# EAGLE schematic wirelessSensor 0.1 (EAGLE 7.6.0)
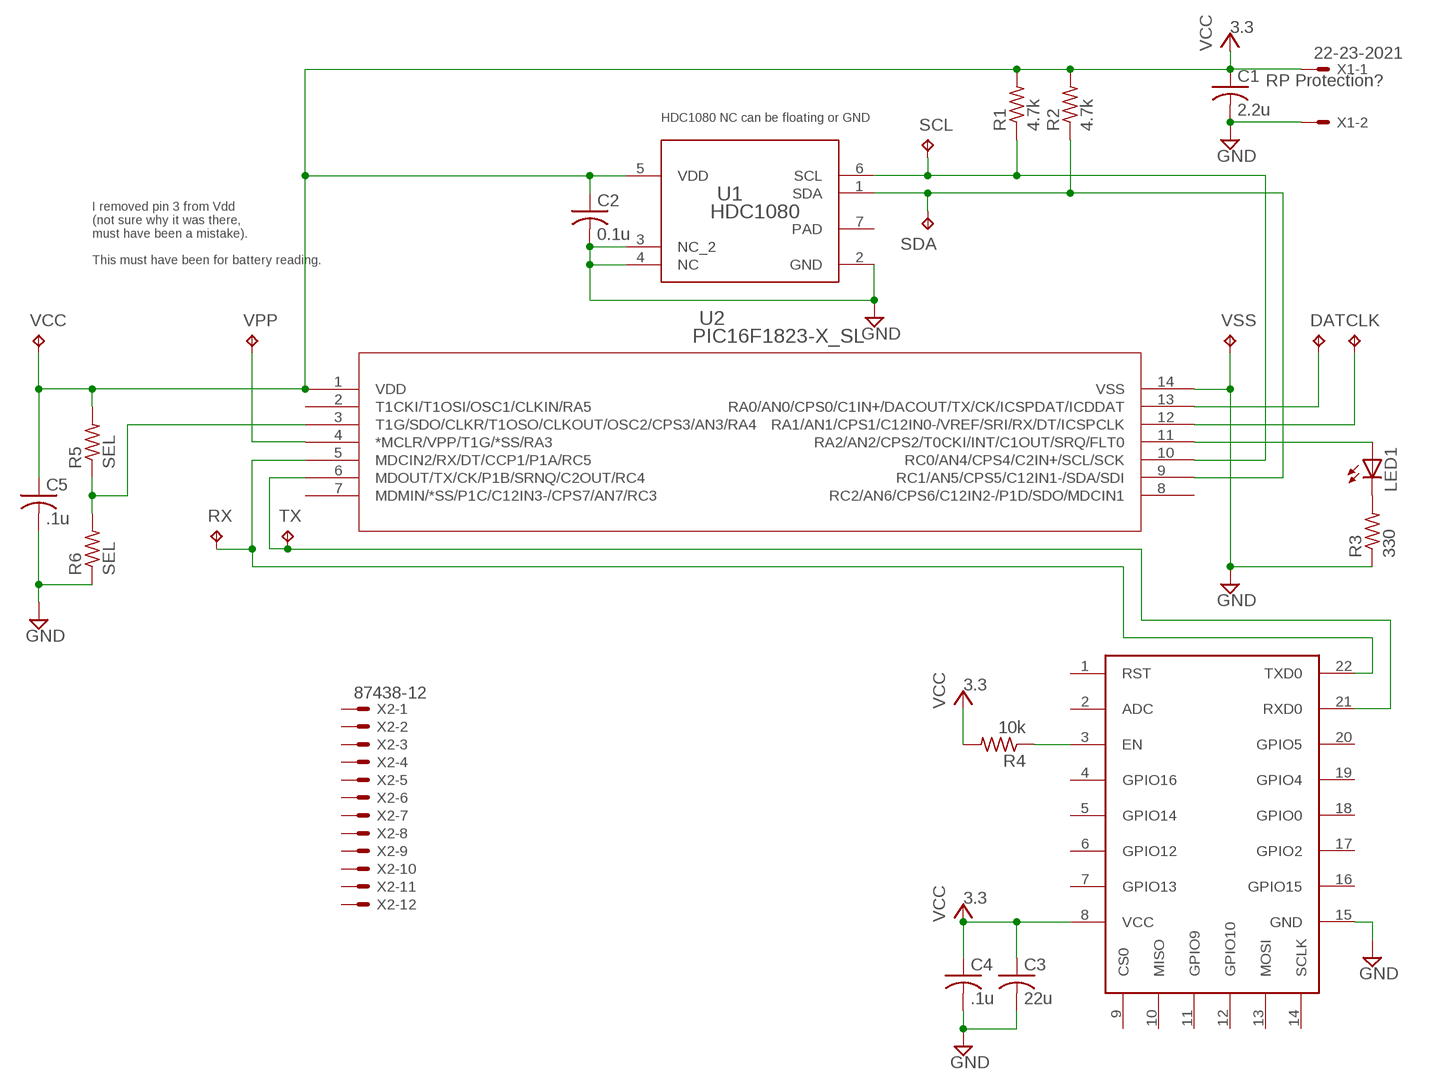
[diagram p0: schematic, sheet 1]

## Parts
C1  2.2u  C-USC0603  [C0603]
C2  0.1u  C-USC0603  [C0603]
C3  22u  C-USC0603K  [C0603K]
C4  .1u  C-USC0603K  [C0603K]
C5  .1u  C-USC0603K  [C0603K]
CLK  TPB1,27  [B1,27]
DAT  TPB1,27  [B1,27]
LED1  LEDCHIP-LED0603  [CHIP-LED0603]
R1  4.7k  R-US_R0603  [R0603]
R2  4.7k  R-US_R0603  [R0603]
R3  330  R-US_R0603  [R0603]
R4  10k  R-US_R0603  [R0603]
R5  SEL  R-US_R0603  [R0603]
R6  SEL  R-US_R0603  [R0603]
RX  TPB1,27  [B1,27]
SCL  TPB1,27  [B1,27]
SDA  TPB1,27  [B1,27]
TX  TPB1,27  [B1,27]
U1  HDC1080  HDC1080DMBR  [DMB0006A]
U2  PIC16F1823-X_SL  [SOIC14-N_MC]
U$1  ESP8266-12E  [ESP8266-12E]
VCC  TPB1,27  [B1,27]
VPP  TPB1,27  [B1,27]
VSS  TPB1,27  [B1,27]
X1  22-23-2021  [22-23-2021]
X2  87438-12  [87438-12]

## Nets
GND: C1.2 C2.2 C3.2 C4.2 C5.2 R3.1 R6.1 U1.2(GND) U1.3(NC_2) U1.4(NC) U2.14(VSS) U$1.15(GND) VSS.TP X1.2
N$1: RX.TP U2.5(MDCIN2/RX/DT/CCP1/P1A/RC5) U$1.22(TXD0)
N$2: R1.1 SCL.TP U1.6(SCL) U2.10(RC0/AN4/CPS4/C2IN+/SCL/SCK)
N$3: R2.1 SDA.TP U1.1(SDA) U2.9(RC1/AN5/CPS5/C12IN1-/SDA/SDI)
N$4: U2.4(*MCLR/VPP/T1G/*SS/RA3) VPP.TP
N$5: DAT.TP U2.13(RA0/AN0/CPS0/C1IN+/DACOUT/TX/CK/ICSPDAT/ICDDAT)
N$6: CLK.TP U2.12(RA1/AN1/CPS1/C12IN0-/VREF/SRI/RX/DT/ICSPCLK)
N$7: R4.1 U$1.3(EN)
N$8: TX.TP U2.6(MDOUT/TX/CK/P1B/SRNQ/C2OUT/RC4) U$1.21(RXD0)
N$9: R5.1 R6.2 U2.3(T1G/SDO/CLKR/T1OSO/CLKOUT/OSC2/CPS3/AN3/RA4)
N$10: LED1.A U2.11(RA2/AN2/CPS2/T0CKI/INT/C1OUT/SRQ/FLT0)
N$11: LED1.C R3.2
VCC: C1.1 C2.1 C3.1 C4.1 C5.1 R1.2 R2.2 R4.2 R5.2 U1.5(VDD) U2.1(VDD) U$1.8(VCC) VCC.TP X1.1
Unconnected: U2.2(T1CKI/T1OSI/OSC1/CLKIN/RA5) U2.7(MDMIN/*SS/P1C/C12IN3-/CPS7/AN7/RC3) U2.8(RC2/AN6/CPS6/C12IN2-/P1D/SDO/MDCIN1) U$1.1(RST) U$1.2(ADC) U$1.4(GPIO16) U$1.5(GPIO14) U$1.6(GPIO12) U$1.7(GPIO13) U$1.9(CS0) U$1.10(MISO) U$1.11(GPIO9) U$1.12(GPIO10) U$1.13(MOSI) U$1.14(SCLK) U$1.16(GPIO15) U$1.17(GPIO2) U$1.18(GPIO0) U$1.19(GPIO4) U$1.20(GPIO5) X2.1 X2.2 X2.3 X2.4 X2.5 X2.6 X2.7 X2.8 X2.9 X2.10 X2.11 X2.12

## Notes on the sheet
- RP Protection?
- HDC1080 NC can be floating or GND
- I removed pin 3 from Vdd 
  (not sure why it was there, 
  must have been a mistake).
  
  This must have been for battery reading.

## Power pins joined to a net without a drawn wire
PAD: U1.7(PAD)

## Library data of the parts
C1-C5 = rcl:C-US: CAPACITOR, American symbol
CLK DAT RX SCL SDA TX VCC VPP VSS = testpad:TP: Test pad
LED1 = led:LED: LED OSRAM: - CHIPLED LG R971, LG N971, LY N971, LG Q971, LY Q971, LO R971, LY R971 LH N974, LH R974 LS Q976, LO Q976, LY Q976 LO Q996 - Hyper CHIPLED LW Q18S LB Q993, LB Q99A, LB R99A - SideLED LS A670, LO A670, LY A670, LG A670, LP A670 LB A673, LV A673, LT A673, LW A673 LH A674 LY A675 LS A676, LA A676, LO A676, LY A676, LW A676 LS A679, LY A679, LG A679 - Hyper Micro SIDELED® LS Y876, LA Y876, LO Y876, LY Y876 LT Y87S - SmartLED LW L88C, LW L88S LB L89C, LB L89S, LG L890 LS L89K, LO L89K, LY L89K LS L896, LA L896, LO L896, LY L896 - TOPLED LS T670, LO T670, LY T670, LG T670, LP T670 LSG T670, LSP T670, LSY T670, LOP T670, LYG T670 LG T671, LOG T671, LSG T671 LB T673, LV T673, LT T673, LW T673 LH T674 LS T676, LA T676, LO T676, LY T676, LB T676, LH T676, LSB T676, LW T676 LB T67C, LV T67C, LT T67C, LS T67K, LO T67K, LY T67K, LW E67C LS E67B, LA E67B, LO E67B, LY E67B, LB E67C, LV E67C, LT E67C LW T67C LS T679, LY T679, LG T679 LS T770, LO T770, LY T770, LG T770, LP T770 LB T773, LV T773, LT T773, LW T773 LH T774 LS E675, LA E675, LY E675, LS T675 LS T776, LA T776, LO T776, LY T776, LB T776 LHGB T686 LT T68C, LB T68C - Hyper Mini TOPLED® LB M676 - Mini TOPLED Santana® LG M470 LS M47K, LO M47K, LY M47K Source: http://www.osram.convergy.de LUXEON: - LUMILED® LXK2-PW12-R00, LXK2-PW12-S00, LXK2-PW14-U00, LXK2-PW14-V00 LXK2-PM12-R00, LXK2-PM12-S00, LXK2-PM14-U00 LXK2-PE12-Q00, LXK2-PE12-R00, LXK2-PE12-S00, LXK2-PE14-T00, LXK2-PE14-U00 LXK2-PB12-K00, LXK2-PB12-L00, LXK2-PB12-M00, LXK2-PB14-N00, LXK2-PB14-P00, LXK2-PB14-Q00 LXK2-PR12-L00, LXK2-PR12-M00, LXK2-PR14-Q00, LXK2-PR14-R00 LXK2-PD12-Q00, LXK2-PD12-R00, LXK2-PD12-S00 LXK2-PH12-R00, LXK2-PH12-S00 LXK2-PL12-P00, LXK2-PL12-Q00, LXK2-PL12-R00 Source: www.luxeon.com KINGBRIGHT: KA-3528ASYC Source: www.kingbright.com
R1-R6 = rcl:R-US_: RESISTOR, American symbol
U1 = wirelessSensor:HDC1080DMBR; ALTERNATEPARTNUMBER: HDC1080DMBT; APPLICATION_BUILDNUMBER: *; COMPTYPE: IC; MANUFACTURER: Texas Instruments; MOUNTTYPE: SMT; PACKAGEREFERENCE: DMB0006A; PARTNUMBER: HDC1080DMBR; PIN_COUNT: 7; REFDES: RefDes; TYPE: TYPE; VALUE: Value
U2 = wirelessSensor:PIC16F1823-X_SL
U$1 = wirelessSensor:ESP8266-12E
X1 = con-molex:22-23-2021: .100" (2.54mm) Center Header - 2 Pin; MF: MOLEX; MPN: 22-23-2021; OC_FARNELL: 1462926; OC_NEWARK: 25C3832
X2 = con-molex:87438-12: Wire-to-Board 1.50mm (.059") Pitch Header - Right Angle, SMT, Shrouded Source: http://www.molex.com/product/micro/87438.html; OC_FARNELL: 1711334; OC_NEWARK: unknown